# Altium schematic sheet SensorCircuit.SchDoc
size A3; SheetNumber: 2; SheetTotal: 9
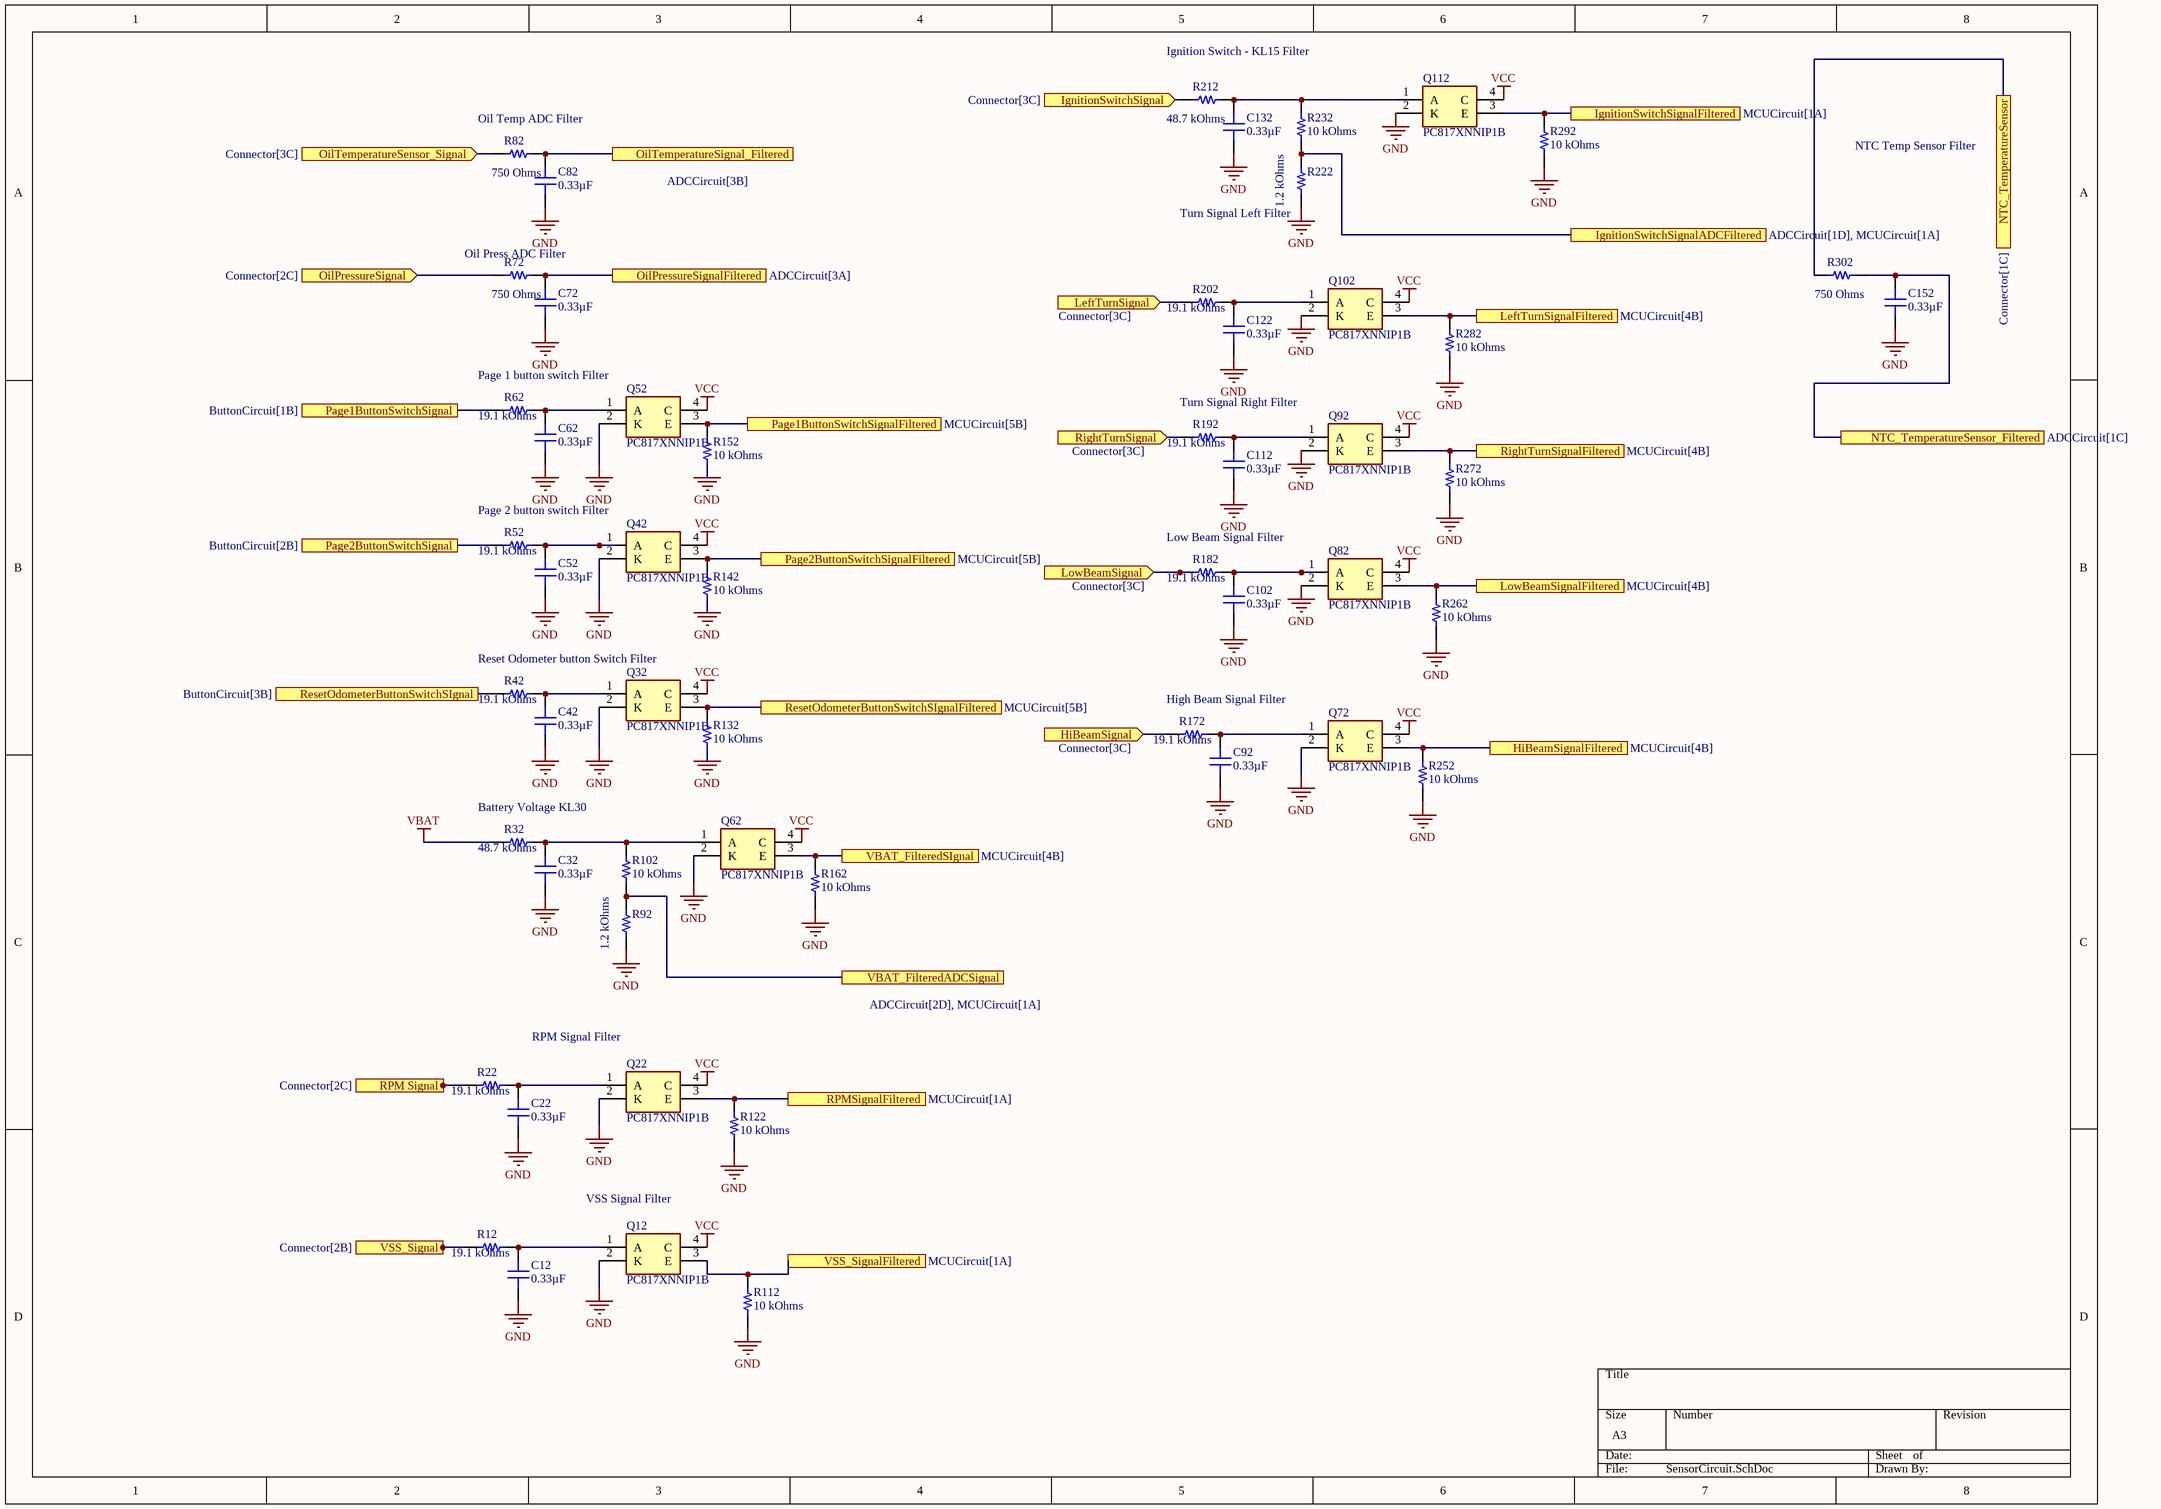
[diagram p0: SensorCircuit.SchDoc]

## Parts
C12  0.33µF  [C0805]
C22  0.33µF  [C0805]
C32  0.33µF  [C0805]
C42  0.33µF  [C0805]
C52  0.33µF  [C0805]
C62  0.33µF  [C0805]
C72  0.33µF  [C0805]
C82  0.33µF  [C0805]
C92  0.33µF  [C0805]
C102  0.33µF  [C0805]
C112  0.33µF  [C0805]
C122  0.33µF  [C0805]
C132  0.33µF  [C0805]
C152  0.33µF  [C0805]
Q12  PC817XNNIP1B  [SOP254P960X420-4N]
Q22  PC817XNNIP1B  [SOP254P960X420-4N]
Q32  PC817XNNIP1B  [SOP254P960X420-4N]
Q42  PC817XNNIP1B  [SOP254P960X420-4N]
Q52  PC817XNNIP1B  [SOP254P960X420-4N]
Q62  PC817XNNIP1B  [SOP254P960X420-4N]
Q72  PC817XNNIP1B  [SOP254P960X420-4N]
Q82  PC817XNNIP1B  [SOP254P960X420-4N]
Q92  PC817XNNIP1B  [SOP254P960X420-4N]
Q102  PC817XNNIP1B  [SOP254P960X420-4N]
Q112  PC817XNNIP1B  [SOP254P960X420-4N]
R12  19.1 kOhms  [RES 0805_2012]
R22  19.1 kOhms  [RES 0805_2012]
R32  48.7 kOhms  [RES 0805_2012]
R42  19.1 kOhms  [RES 0805_2012]
R52  19.1 kOhms  [RES 0805_2012]
R62  19.1 kOhms  [RES 0805_2012]
R72  750 Ohms  [RES 0805_2012]
R82  750 Ohms  [RES 0805_2012]
R92  1.2 kOhms  [RES 0805_2012]
R102  10 kOhms  [RES 0805_2012]
R112  10 kOhms  [RES 0805_2012]
R122  10 kOhms  [RES 0805_2012]
R132  10 kOhms  [RES 0805_2012]
R142  10 kOhms  [RES 0805_2012]
R152  10 kOhms  [RES 0805_2012]
R162  10 kOhms  [RES 0805_2012]
R172  19.1 kOhms  [RES 0805_2012]
R182  19.1 kOhms  [RES 0805_2012]
R192  19.1 kOhms  [RES 0805_2012]
R202  19.1 kOhms  [RES 0805_2012]
R212  48.7 kOhms  [RES 0805_2012]
R222  1.2 kOhms  [RES 0805_2012]
R232  10 kOhms  [RES 0805_2012]
R252  10 kOhms  [RES 0805_2012]
R262  10 kOhms  [RES 0805_2012]
R272  10 kOhms  [RES 0805_2012]
R282  10 kOhms  [RES 0805_2012]
R292  10 kOhms  [RES 0805_2012]
R302  750 Ohms  [RES 0805_2012]

## Ports
HiBeamSignal (in, see Connector[3C]), HiBeamSignalFiltered (see MCUCircuit[4B]), IgnitionSwitchSignal (in, see Connector[3C]), IgnitionSwitchSignalADCFiltered (see ADCCircuit[1D], MCUCircuit[1A]), IgnitionSwitchSignalFiltered (see MCUCircuit[1A]), LeftTurnSignal (in, see Connector[3C]), LeftTurnSignalFiltered (see MCUCircuit[4B]), LowBeamSignal (in, see Connector[3C]), LowBeamSignalFiltered (see MCUCircuit[4B]), NTC_TemperatureSensor (see Connector[1C]), NTC_TemperatureSensor_Filtered (see ADCCircuit[1C]), OilPressureSignal (in, see Connector[2C]), OilPressureSignalFiltered (see ADCCircuit[3A]), OilTemperatureSensor_Signal (in, see Connector[3C]), OilTemperatureSignal_Filtered (see ADCCircuit[3B]), Page1ButtonSwitchSignal (see ButtonCircuit[1B]), Page1ButtonSwitchSignalFiltered (see MCUCircuit[5B]), Page2ButtonSwitchSignal (see ButtonCircuit[2B]), Page2ButtonSwitchSignalFiltered (see MCUCircuit[5B]), ResetOdometerButtonSwitchSIgnal (see ButtonCircuit[3B]), ResetOdometerButtonSwitchSIgnalFiltered (see MCUCircuit[5B]), RightTurnSignal (in, see Connector[3C]), RightTurnSignalFiltered (see MCUCircuit[4B]), RPM Signal (see Connector[2C]), RPMSignalFiltered (see MCUCircuit[1A]), VBAT_FilteredADCSignal (see ADCCircuit[2D], MCUCircuit[1A]), VBAT_FilteredSIgnal (see MCUCircuit[4B]), VSS_Signal (in, see Connector[2B]), VSS_SignalFiltered (see MCUCircuit[1A])

## Nets
GND: C12.1 C22.1 C32.1 C42.1 C52.1 C62.1 C72.1 C82.1 C92.1 C102.1 C112.1 C122.1 C132.1 C152.1 Q12.2(K) Q22.2(K) Q32.2(K) Q42.2(K) Q52.2(K) Q62.2(K) Q72.2(K) Q82.2(K) Q92.2(K) Q102.2(K) Q112.2(K) R92.1 R112.1 R122.1 R132.1 R142.1 R152.1 R162.1 R222.1 R252.1 R262.1 R272.1 R282.1 R292.1
VBAT: R32.1
VCC: Q12.4(C) Q22.4(C) Q32.4(C) Q42.4(C) Q52.4(C) Q62.4(C) Q72.4(C) Q82.4(C) Q92.4(C) Q102.4(C) Q112.4(C)
HiBeamSignal: R172.1 ; port HiBeamSignal
HiBeamSignalFiltered: Q72.3(E) R252.2 ; port HiBeamSignalFiltered
IgnitionSwitchSignal: R212.1 ; port IgnitionSwitchSignal
IgnitionSwitchSignalADCFiltered: R222.2 R232.1 ; port IgnitionSwitchSignalADCFiltered
IgnitionSwitchSignalFiltered: Q112.3(E) R292.2 ; port IgnitionSwitchSignalFiltered
LeftTurnSignal: R202.1 ; port LeftTurnSignal
LeftTurnSignalFiltered: Q102.3(E) R282.2 ; port LeftTurnSignalFiltered
LowBeamSignal: R182.1 ; port LowBeamSignal
LowBeamSignalFiltered: Q82.3(E) R262.2 ; port LowBeamSignalFiltered
NTC_TemperatureSensor: R302.1 ; port NTC_TemperatureSensor
NTC_TemperatureSensor_Filtered: C152.2 R302.2 ; port NTC_TemperatureSensor_Filtered
OilPressureSignal: R72.1 ; port OilPressureSignal
OilPressureSignalFiltered: C72.2 R72.2 ; port OilPressureSignalFiltered
OilTemperatureSensor_Signal: R82.1 ; port OilTemperatureSensor_Signal
OilTemperatureSignal_Filtered: C82.2 R82.2 ; port OilTemperatureSignal_Filtered
Page1ButtonSwitchSignal: R62.1 ; port Page1ButtonSwitchSignal
Page1ButtonSwitchSignalFiltered: Q52.3(E) R152.2 ; port Page1ButtonSwitchSignalFiltered
Page2ButtonSwitchSignal: R52.1 ; port Page2ButtonSwitchSignal
Page2ButtonSwitchSignalFiltered: Q42.3(E) R142.2 ; port Page2ButtonSwitchSignalFiltered
ResetOdometerButtonSwitchSIgnal: R42.1 ; port ResetOdometerButtonSwitchSIgnal
ResetOdometerButtonSwitchSIgnalFiltered: Q32.3(E) R132.2 ; port ResetOdometerButtonSwitchSIgnalFiltered
RightTurnSignal: R192.1 ; port RightTurnSignal
RightTurnSignalFiltered: Q92.3(E) R272.2 ; port RightTurnSignalFiltered
RPM Signal: R22.1 ; port RPM Signal
RPMSignalFiltered: Q22.3(E) R122.2 ; port RPMSignalFiltered
VBAT_FilteredADCSignal: R92.2 R102.1 ; port VBAT_FilteredADCSignal
VBAT_FilteredSIgnal: Q62.3(E) R162.2 ; port VBAT_FilteredSIgnal
VSS_Signal: R12.1 ; port VSS_Signal
VSS_SignalFiltered: Q12.3(E) R112.2 ; port VSS_SignalFiltered
NetC12_2: C12.2 Q12.1(A) R12.2
NetC22_2: C22.2 Q22.1(A) R22.2
NetC32_2: C32.2 Q62.1(A) R32.2 R102.2
NetC42_2: C42.2 Q32.1(A) R42.2
NetC52_2: C52.2 Q42.1(A) R52.2
NetC62_2: C62.2 Q52.1(A) R62.2
NetC92_2: C92.2 Q72.1(A) R172.2
NetC102_2: C102.2 Q82.1(A) R182.2
NetC112_2: C112.2 Q92.1(A) R192.2
NetC122_2: C122.2 Q102.1(A) R202.2
NetC132_2: C132.2 Q112.1(A) R212.2 R232.2

## Notes on the sheet
- Ignition Switch - KL15 Filter
- Oil Temp ADC Filter
- NTC Temp Sensor Filter
- (near R222) Turn Signal Left Filter
- (near R72) Oil Press ADC Filter
- Page 1 button switch Filter
- Turn Signal Right Filter
- Page 2 button switch Filter
- Low Beam Signal Filter
- Reset Odometer button Switch Filter
- High Beam Signal Filter
- Battery Voltage KL30
- RPM Signal Filter
- (near Q12) VSS Signal Filter

## Library data of the parts
C12 C22 C32 C42 C52 C62 C72 C82 C92 C102 C112 C122 C132 C152 = 0805YC334JAT2A: CAP CER 0.33UF 16V X7R 0805; manufacturer: AVX Corporation; Tolerance: ±5%; Part Number: 0805YC334JAT2A; Value: 0.33µF; Applications: General Purpose; Capacitance: 0.33µF; componentlink1description: Datasheet; componentlink1url: http://datasheets.avx.com/X7RDielectric.pdf; componentlink2description: DigiKey Link; componentlink2url: http://digikey.com/product-detail/en/avx-corporation/0805YC334JAT2A/478-5273-1-ND/1950940; Device Package: 0805 (2012 Metric); lastupdated: 9/2/2020 01:04:40; Lifecycle Status: Active; Minimum Order: 1; Mounting Type: Surface Mount, MLCC; Operating Temperature: -55°C ~ 125°C; Package / Case: 0805 (2012 Metric); packaging: TapeAndReel; partid: 3309; Part Status: Active; price: 0.15; series: -; Size / Dimension: 0.079" L x 0.049" W (2.01mm x 1.25mm); Supplier 1: DigiKey; Supplier Part Number 1: 478-5273-1-ND; Temperature Coefficient: X7R; Thickness (Max): 0.055" (1.40mm); Voltage - Rated: 16V
Q12 Q22 Q32 Q42 Q52 Q62 Q72 Q82 Q92 Q102 Q112 = PC817XNNIP1B: Phototransistor; Manufacturer_Name: Sharp Microelectronics; Datasheet Link: https://www.mouser.com/datasheet/2/365/SHARP_PC817XNNIP1B-1360398.pdf; Height: 4.2mm; Manufacturer_Part_Number: PC817XNNIP1B; Mouser Part Number: 852-PC817XNNIP1B; Mouser Price/Stock: https://www.mouser.co.uk/ProductDetail/Sharp-Microelectronics/PC817XNNIP1B?qs=rrS6PyfT74dJvnx7366b6Q%3D%3D; Arrow Part Number: PC817XNNIP1B; Arrow Price/Stock: https://www.arrow.com/en/products/pc817xnnip1b/sharp
R12 R22 R42 R52 R62 R172 R182 R192 R202 = CRCW080519K1FKEA: RES SMD 19.1K OHM 1% 1/8W 0805; Manufacturer: Vishay Dale; Power (Watts): 0.125W, 1/8W; Temperature Coefficient: ±100ppm/°C; Part Number: CRCW080519K1FKEA; Value: 19.1 kOhms; ComponentLink1Description: Datasheet; ComponentLink1URL: http://www.vishay.com/docs/20035/dcrcwe3.pdf; ComponentLink2Description: DigiKey Link; ComponentLink2URL: https://www.digikey.com/en/products/detail/vishay-dale/CRCW080519K1FKEA/1175781; Composition: Thick Film; Device Package: 0805 (2012 Metric); Features: Automotive AEC-Q200; Height - Seated (Max): 0.020" (0.50mm); LastUpdated: 2/8/2024 21:02:03; Lifecycle Status: Active; Minimum Order: 1; Number of Terminations: 2; Operating Temperature: -55°C ~ 155°C; Package / Case: 0805 (2012 Metric); Packaging: TapeAndReel; PartId: 35928; Part Status: Active; Price: 0.01; Ratings: AEC-Q200; Resistance: 19.1 kOhms; Series: CRCW; Size / Dimension: 0.079" L x 0.049" W (2.00mm x 1.25mm); Supplier 1: DigiKey; Supplier Part Number 1: 541-19.1KCCT-ND; Supplier Device Package: 0805; Tolerance: ±1%
R32 R212 = CRCW080548K7FKEA: RES SMD 48.7K OHM 1% 1/8W 0805; Manufacturer: Vishay Dale; Power (Watts): 0.125W, 1/8W; Temperature Coefficient: ±100ppm/°C; Part Number: CRCW080548K7FKEA; Value: 48.7 kOhms; ComponentLink1Description: Datasheet; ComponentLink1URL: http://www.vishay.com/docs/20035/dcrcwe3.pdf; ComponentLink2Description: DigiKey Link; ComponentLink2URL: https://www.digikey.com/en/products/detail/vishay-dale/CRCW080548K7FKEA/1175829; Composition: Thick Film; Device Package: 0805 (2012 Metric); Features: Automotive AEC-Q200; Height - Seated (Max): 0.020" (0.50mm); LastUpdated: 2/8/2024 21:02:03; Lifecycle Status: Active; Minimum Order: 1; Number of Terminations: 2; Operating Temperature: -55°C ~ 155°C; Package / Case: 0805 (2012 Metric); Packaging: TapeAndReel; PartId: 35941; Part Status: Active; Price: 0.01; Ratings: AEC-Q200; Resistance: 48.7 kOhms; Series: CRCW; Size / Dimension: 0.079" L x 0.049" W (2.00mm x 1.25mm); Supplier 1: DigiKey; Supplier Part Number 1: 541-48.7KCCT-ND; Supplier Device Package: 0805; Tolerance: ±1%
R72 R82 R302 = RNCF0805BTE750R: RES 750 OHM 0.1% 1/8W 0805; Manufacturer: Stackpole Electronics Inc; Power (Watts): 0.125W, 1/8W; Temperature Coefficient: ±25ppm/°C; Part Number: RNCF0805BTE750R; Value: 750 Ohms; ComponentLink1Description: Datasheet; ComponentLink1URL: https://www.seielect.com/catalog/sei-rncf.pdf; ComponentLink2Description: DigiKey Link; ComponentLink2URL: http://digikey.com/product-detail/en/stackpole-electronics-inc/RNCF0805BTE750R/RNCF0805BTE750RCT-ND/2027163; Composition: Thin Film; Device Package: 0805 (2012 Metric); Features: Automotive AEC-Q200; Height - Seated (Max): 0.026" (0.65mm); LastUpdated: 2/8/2024 21:02:34; Lifecycle Status: Active; Minimum Order: 1; Number of Terminations: 2; Operating Temperature: -55°C ~ 155°C; Package / Case: 0805 (2012 Metric); Packaging: TapeAndReel; PartId: 28885; Part Status: Active; Price: 0.08; Ratings: AEC-Q200; Resistance: 750 Ohms; Series: RNCF; Size / Dimension: 0.079" L x 0.049" W (2.00mm x 1.25mm); Supplier 1: DigiKey; Supplier Part Number 1: RNCF0805BTE750RCT-ND; Supplier Device Package: 0805; Tolerance: ±0.1%
R92 R222 = CPF0805B1K2E1: RES SMD 1.2K OHM 0.1% 1/10W 0805; Manufacturer: TE Connectivity Passive Product; Power (Watts): 0.1W, 1/10W; Temperature Coefficient: ±25ppm/°C; Part Number: CPF0805B1K2E1; Value: 1.2 kOhms; ComponentLink1Description: Datasheet; ComponentLink1URL: https://www.te.com/commerce/DocumentDelivery/DDEController?Action=srchrtrv&DocNm=1773200&DocType=DS&DocLang=English; ComponentLink2Description: DigiKey Link; ComponentLink2URL: https://www.digikey.com/en/products/detail/te-connectivity-passive-product/CPF0805B1K2E1/2382033; Composition: Thin Film; Device Package: 0805 (2012 Metric); Height - Seated (Max): 0.026" (0.65mm); LastUpdated: 2/8/2024 21:00:58; Lifecycle Status: Active; Minimum Order: 1; Number of Terminations: 2; Operating Temperature: -55°C ~ 155°C; Package / Case: 0805 (2012 Metric); Packaging: TapeAndReel; PartId: 48602; Part Status: Active; Price: 0.12; Resistance: 1.2 kOhms; Series: CPF, Neohm; Size / Dimension: 0.079" L x 0.049" W (2.00mm x 1.25mm); Supplier 1: DigiKey; Supplier Part Number 1: A103167CT-ND; Supplier Device Package: 0805; Tolerance: ±0.1%
R102 R232 = 9-2176375-1: RES 10K OHM 0.1% 1/5W 0805; Manufacturer: TE Connectivity Passive Product; Power (Watts): 0.2W, 1/5W; Temperature Coefficient: ±10ppm/°C; Part Number: 9-2176375-1; Value: 10 kOhms; ComponentLink1Description: Datasheet; ComponentLink1URL: https://www.te.com/usa-en/product-9-2176375-1.datasheet.pdf; ComponentLink2Description: DigiKey Link; ComponentLink2URL: https://www.digikey.com/en/products/detail/te-connectivity-passive-product/9-2176375-1/18110542; Composition: Thin Film; Device Package: 0805 (2012 Metric); Features: Anti-Sulfur, Automotive AEC-Q200, Moisture Resistant; Height - Seated (Max): 0.026" (0.65mm); LastUpdated: 2/8/2024 21:00:11; Lifecycle Status: Active; Minimum Order: 1; Number of Terminations: 2; Operating Temperature: -55°C ~ 155°C; Package / Case: 0805 (2012 Metric); Packaging: TapeAndReel; PartId: 76290; Part Status: Active; Price: 0.39; Ratings: AEC-Q200; Resistance: 10 kOhms; Series: RQ73; Size / Dimension: 0.079" L x 0.049" W (2.00mm x 1.25mm); Supplier 1: DigiKey; Supplier Part Number 1: 1712-9-2176375-1CT-ND; Supplier Device Package: 0805; Tolerance: ±0.1%
R112 R122 R132 R142 R152 R162 R252 R262 R272 R282 R292 = 3430A2F10KTDF: 3430 A2 1% 10K 100PPM 1K RL; Manufacturer: TE Connectivity Passive Product; Power (Watts): 1W; Temperature Coefficient: ±100ppm/°C; Part Number: 3430A2F10KTDF; Value: 10 kOhms; ComponentLink2Description: DigiKey Link; ComponentLink2URL: https://www.digikey.com/en/products/detail/te-connectivity-passive-product/3430A2F10KTDF/17764190; Composition: Thick Film; Device Package: 0805 (2012 Metric); Features: Automotive AEC-Q200; Height - Seated (Max): 0.026" (0.65mm); LastUpdated: 2/8/2024 21:00:03; Lifecycle Status: Active; Minimum Order: 1; Number of Terminations: 2; Operating Temperature: -55°C ~ 155°C; Package / Case: 0805 (2012 Metric); Packaging: TapeAndReel; PartId: 77781; Part Status: Active; Price: 0.02; Ratings: AEC-Q200; Resistance: 10 kOhms; Series: 3430; Size / Dimension: 0.049" L x 0.079" W (1.25mm x 2.00mm); Supplier 1: DigiKey; Supplier Part Number 1: 1712-3430A2F10KTDFCT-ND; Supplier Device Package: 0508; Tolerance: ±1%